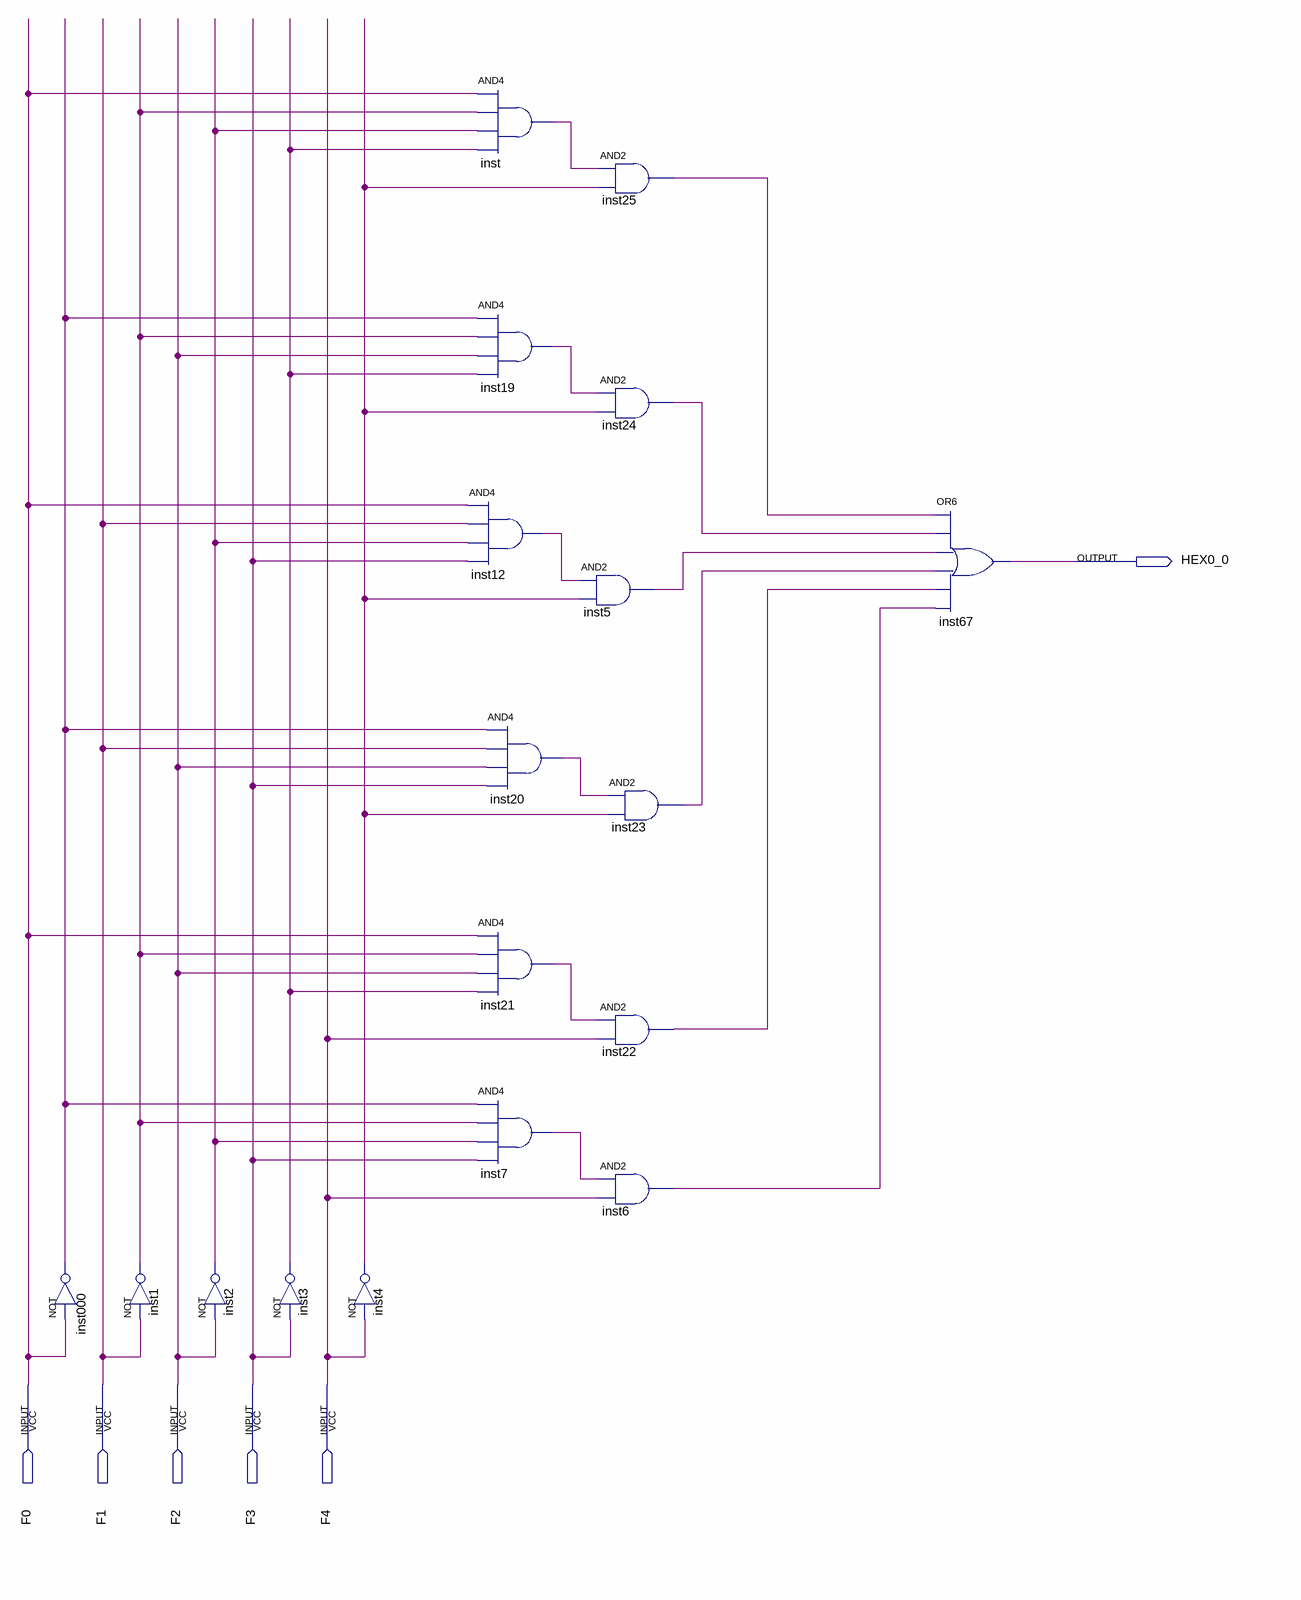
[diagram p0: schematic sheet]
// Quartus schematic HEX00.bdf as structural Verilog: 18 symbols, 6 pins
module HEX00 (
  input  F0,
  input  F1,
  input  F2,
  input  F3,
  input  F4,
  output HEX0_0
);

  wire inst000_out, inst1_out, inst2_out, inst3_out, inst4_out, inst5_out, inst6_out, inst7_out, inst12_out,
       inst19_out, inst20_out, inst21_out, inst22_out, inst23_out, inst24_out, inst25_out, inst_out;

  not inst000 (inst000_out, F0);
  not inst1 (inst1_out, F1);
  not inst2 (inst2_out, F2);
  not inst3 (inst3_out, F3);
  not inst4 (inst4_out, F4);
  and inst (inst_out, F0, inst1_out, inst2_out, inst3_out);
  and inst19 (inst19_out, inst000_out, inst1_out, F2, inst3_out);
  and inst12 (inst12_out, F0, F1, inst2_out, F3);
  and inst20 (inst20_out, inst000_out, F1, F2, F3);
  and inst21 (inst21_out, F0, inst1_out, F2, inst3_out);
  and inst7 (inst7_out, inst000_out, inst1_out, inst2_out, F3);
  and inst25 (inst25_out, inst_out, inst4_out);
  and inst24 (inst24_out, inst19_out, inst4_out);
  and inst5 (inst5_out, inst12_out, inst4_out);
  and inst22 (inst22_out, inst21_out, F4);
  and inst6 (inst6_out, inst7_out, F4);
  and inst23 (inst23_out, inst20_out, inst4_out);
  or inst67 (HEX0_0, inst25_out, inst24_out, inst5_out, inst23_out, inst22_out, inst6_out);
endmodule
